# EAGLE design TinyCam Carrier Board (EAGLE 9.6.2)
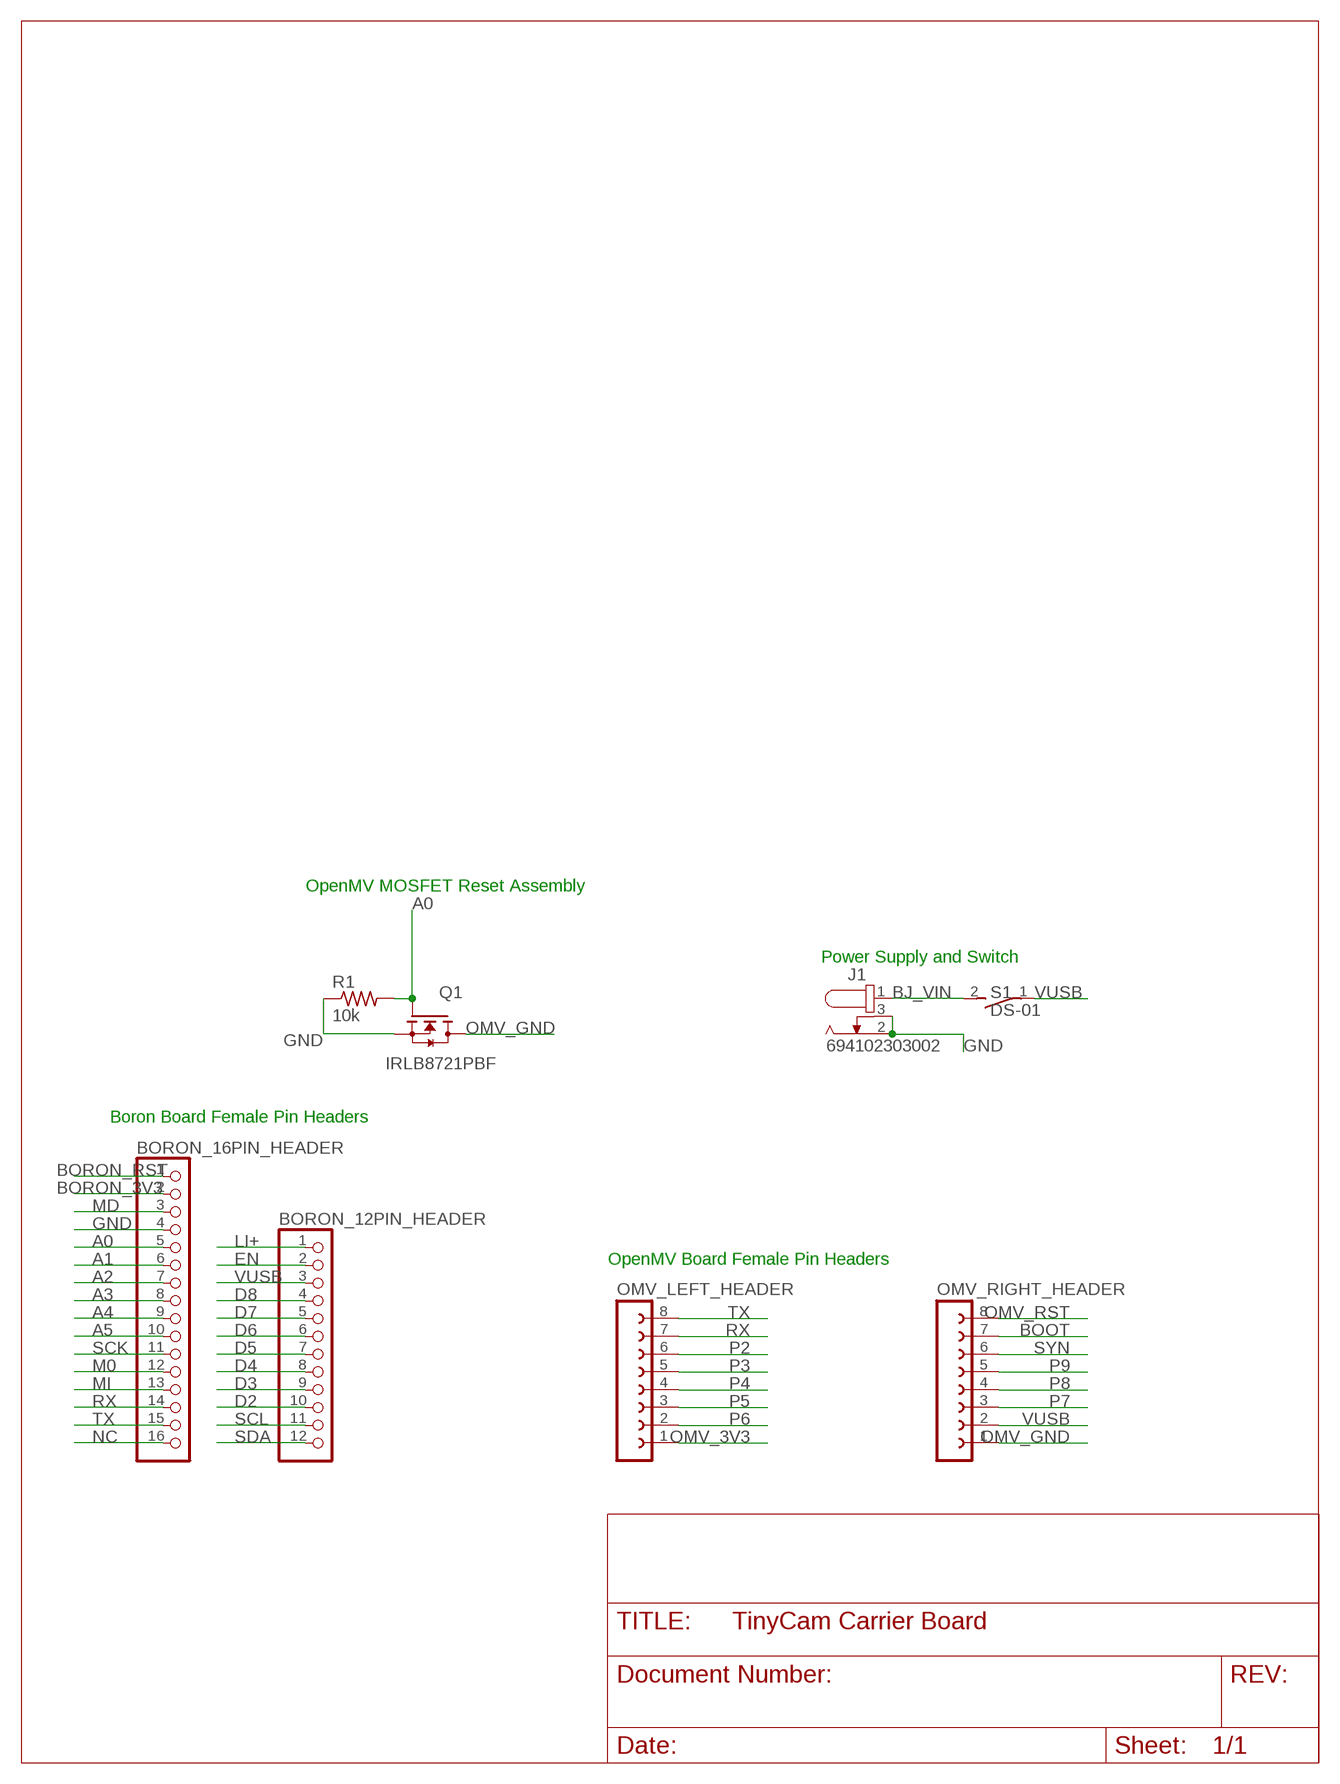
[diagram p0: schematic, sheet 1]

## Parts
BORON_12PIN_HEADER  PINHD-1X12  [1X12]
BORON_16PIN_HEADER  PINHD-1X16  [1X16]
J1  694102303002  694102303002  [694102303002]
OMV_LEFT_HEADER  FE08-1  [FE08]
OMV_RIGHT_HEADER  FE08-1  [FE08]
Q1  IRLB8721PBF  [TO254P1067X483X2057-3]
R1  10k  R-US_0204/7  [0204/7]
S1  DS-01  DS01E  [DS-01]

## Nets
A0: BORON_16PIN_HEADER.5 Q1.1(G) R1.2
A1: BORON_16PIN_HEADER.6
A2: BORON_16PIN_HEADER.7
A3: BORON_16PIN_HEADER.8
A4: BORON_16PIN_HEADER.9
A5: BORON_16PIN_HEADER.10
BJ_VIN: J1.1 S1.2
BOOT: OMV_RIGHT_HEADER.7
BORON_3V3: BORON_16PIN_HEADER.2
BORON_RST: BORON_16PIN_HEADER.1
D2: BORON_12PIN_HEADER.10
D3: BORON_12PIN_HEADER.9
D4: BORON_12PIN_HEADER.8
D5: BORON_12PIN_HEADER.7
D6: BORON_12PIN_HEADER.6
D7: BORON_12PIN_HEADER.5
D8: BORON_12PIN_HEADER.4
EN: BORON_12PIN_HEADER.2
GND: BORON_16PIN_HEADER.4 J1.2 J1.3 Q1.3(S) R1.1
LI+: BORON_12PIN_HEADER.1
M0: BORON_16PIN_HEADER.12
MD: BORON_16PIN_HEADER.3
MI: BORON_16PIN_HEADER.13
NC: BORON_16PIN_HEADER.16
OMV_3V3: OMV_LEFT_HEADER.1
OMV_GND: OMV_RIGHT_HEADER.1 Q1.2(D)
OMV_RST: OMV_RIGHT_HEADER.8
P2: OMV_LEFT_HEADER.6
P3: OMV_LEFT_HEADER.5
P4: OMV_LEFT_HEADER.4
P5: OMV_LEFT_HEADER.3
P6: OMV_LEFT_HEADER.2
P7: OMV_RIGHT_HEADER.3
P8: OMV_RIGHT_HEADER.4
P9: OMV_RIGHT_HEADER.5
RX: BORON_16PIN_HEADER.14 OMV_LEFT_HEADER.7
SCK: BORON_16PIN_HEADER.11
SCL: BORON_12PIN_HEADER.11
SDA: BORON_12PIN_HEADER.12
SYN: OMV_RIGHT_HEADER.6
TX: BORON_16PIN_HEADER.15 OMV_LEFT_HEADER.8
VUSB: BORON_12PIN_HEADER.3 OMV_RIGHT_HEADER.2 S1.1

## Notes on the sheet
- OpenMV MOSFET Reset Assembly
- Power Supply and Switch
- Boron Board Female Pin Headers
- OpenMV Board Female Pin Headers

## Library data of the parts
BORON_12PIN_HEADER = pinhead:PINHD-1X12: PIN HEADER
BORON_16PIN_HEADER = pinhead:PINHD-1X16: PIN HEADER
J1 = Eagle_WR-DC (rev21a):694102303002: WR-DC DC Power Jack Right Angled (4.2) KIND PROPERTIES Quality Class 5 000 Mating cycles Type Right Angled MATERIAL PROPERTIES Insulator Material PA66 Insulator Flammability Rating UL94 V-0 Color Black Contact Material Copper Alloy Contact Type Stamped Center Pin Plating Gold Center Pin Terminal Plating Tin Tip Spring Material Tin Shunt Terminal Plating Tin GENERAL INFORMATION Operating Temperature -40 up to +85 °C Compliance RoHS ELECTRICAL PROPERTIES IR 1 2 A Working Voltage 30 V (AC) Withstanding Voltage 500 V (AC) Contact Resistance 50 mΩ RISO 100 MΩ PACKAGING PROPERTIES Packaging Bag <https://www.we-online.com/catalog/media/o64601v209%20Family_WR-DC_THT_6941xx303002.jpg> Details see: https://www.we-online.com/catalog/en/DC_RIGHT_ANGLED_4_2_69410X303002 Updated by Ella Wu 2021-09-30 2021(C) Wurth Elektronik; DATASHEET-URL: https://www.we-online.com/catalog/datasheet/694102303002.pdf; IR: 2A; MOUNT: THT; PART-NUMBER: 694102303002; TYPE: Right Angled; WORKING-VOLTAGE: 30V(AC)
OMV_LEFT_HEADER OMV_RIGHT_HEADER = con-lsta:FE08-1: FEMALE HEADER; OC_FARNELL: unknown; OC_NEWARK: unknown
Q1 = IRLB8721PBF:IRLB8721PBF: Single N-Channel 30 V 8.7 mOhm 13 nC HEXFET® Power Mosfet - TO-220-3; CHECK_PRICES: https://www.snapeda.com/parts/IRLB8721PBF/Infineon/view-part/?ref=eda; DESCRIPTION: IRLB8721PBF N-channel MOSFET Transistor, 62 A, 30 V, 3-Pin TO-220AB | Infineon IRLB8721PBF; DIGIKEY_PART_NUMBER: IRLB8721PBF-ND; MF: Infineon Technologies; MP: IRLB8721PBF; PACKAGE: TO-220-3 Infineon; SNAPEDA_LINK: https://www.snapeda.com/parts/IRLB8721PBF/Infineon/view-part/?ref=snap
R1 = rcl:R-US_: RESISTOR, American symbol; SPICEPREFIX: R
S1 = Switch:DS01E: DIL/CODE SWITCH; CATEGORY: SWITCH; TYPE: SPST

## Board
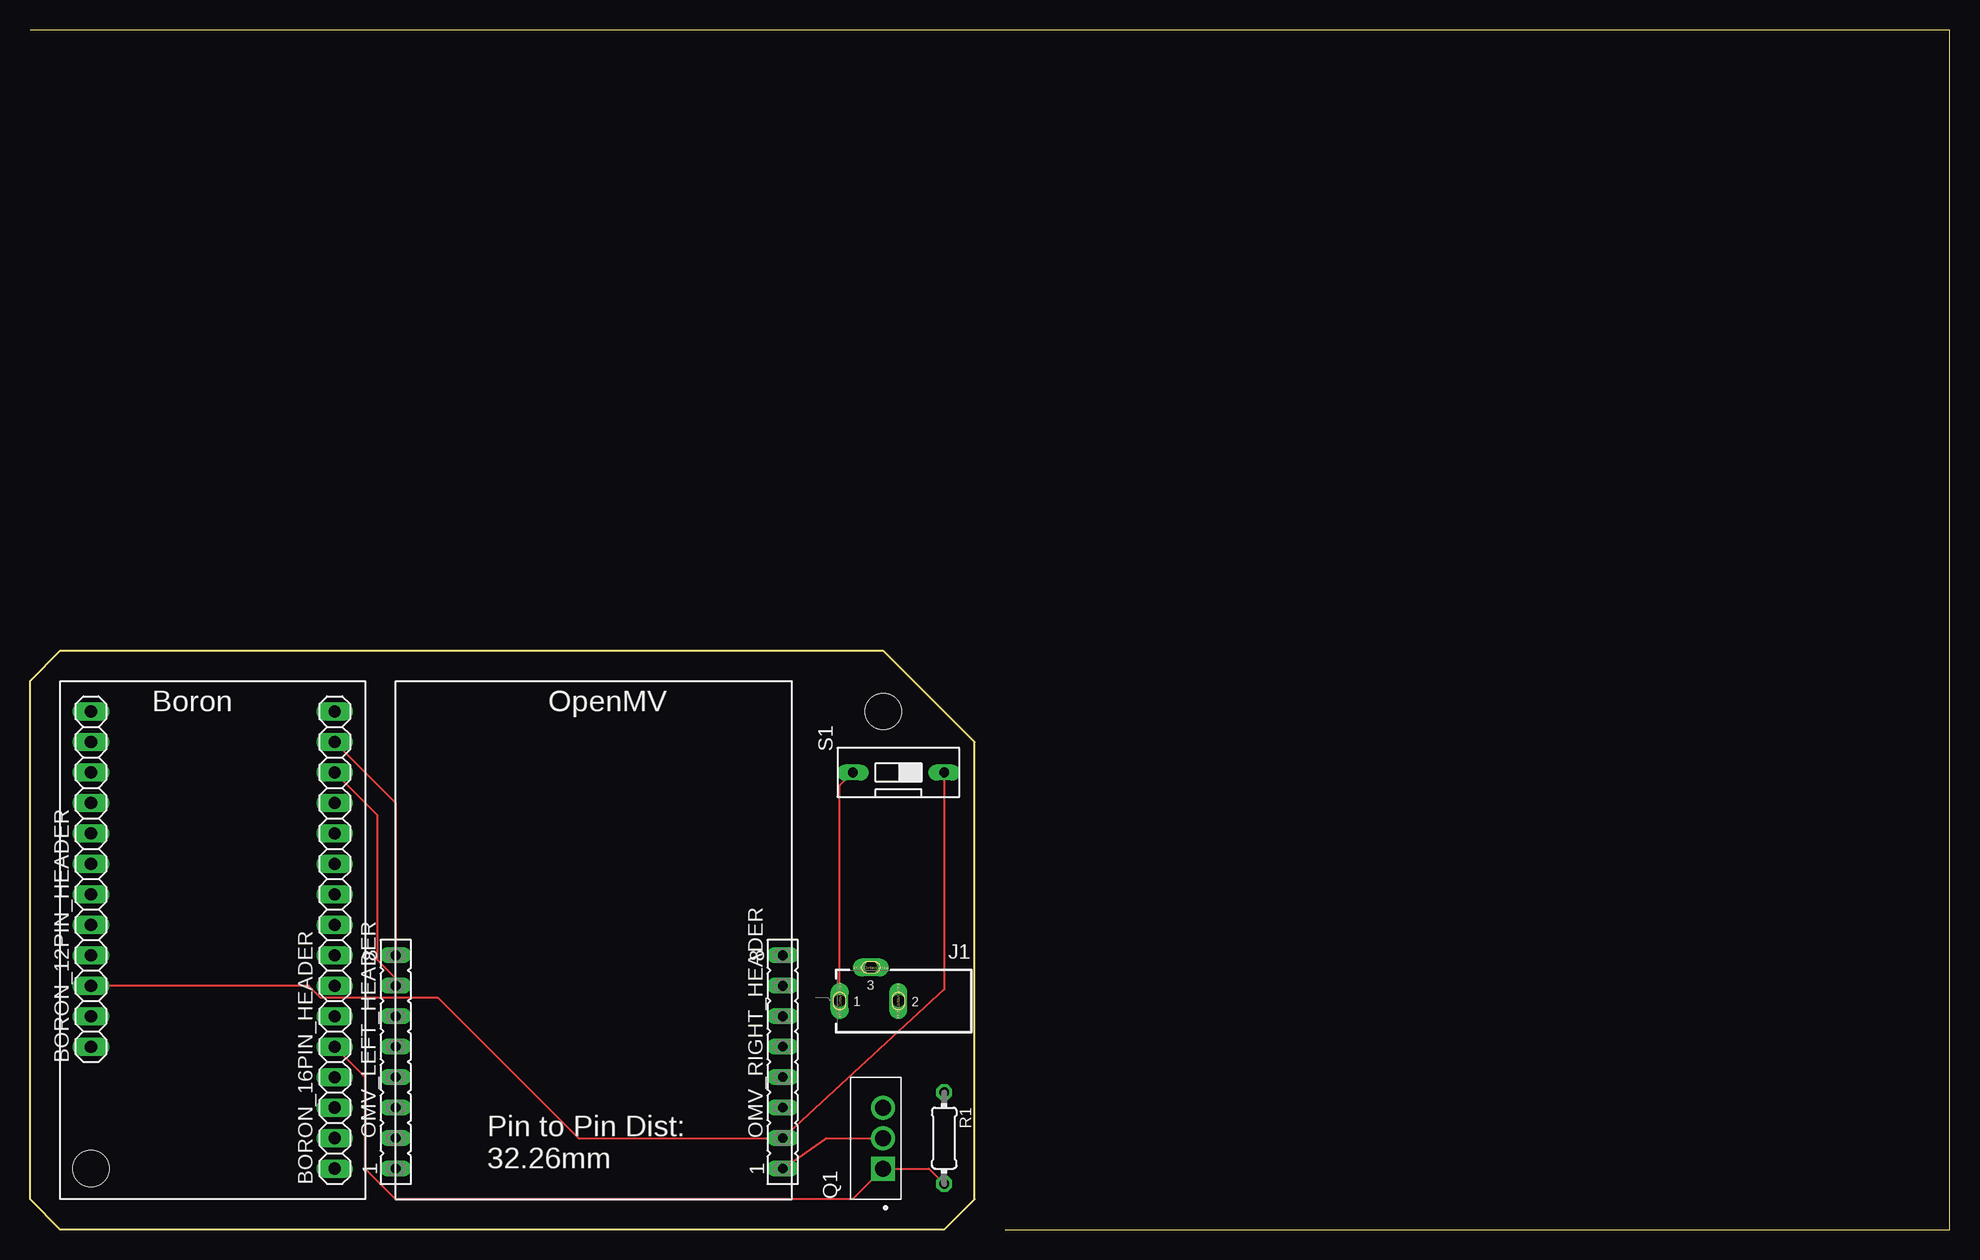
[diagram p1: board, top side]
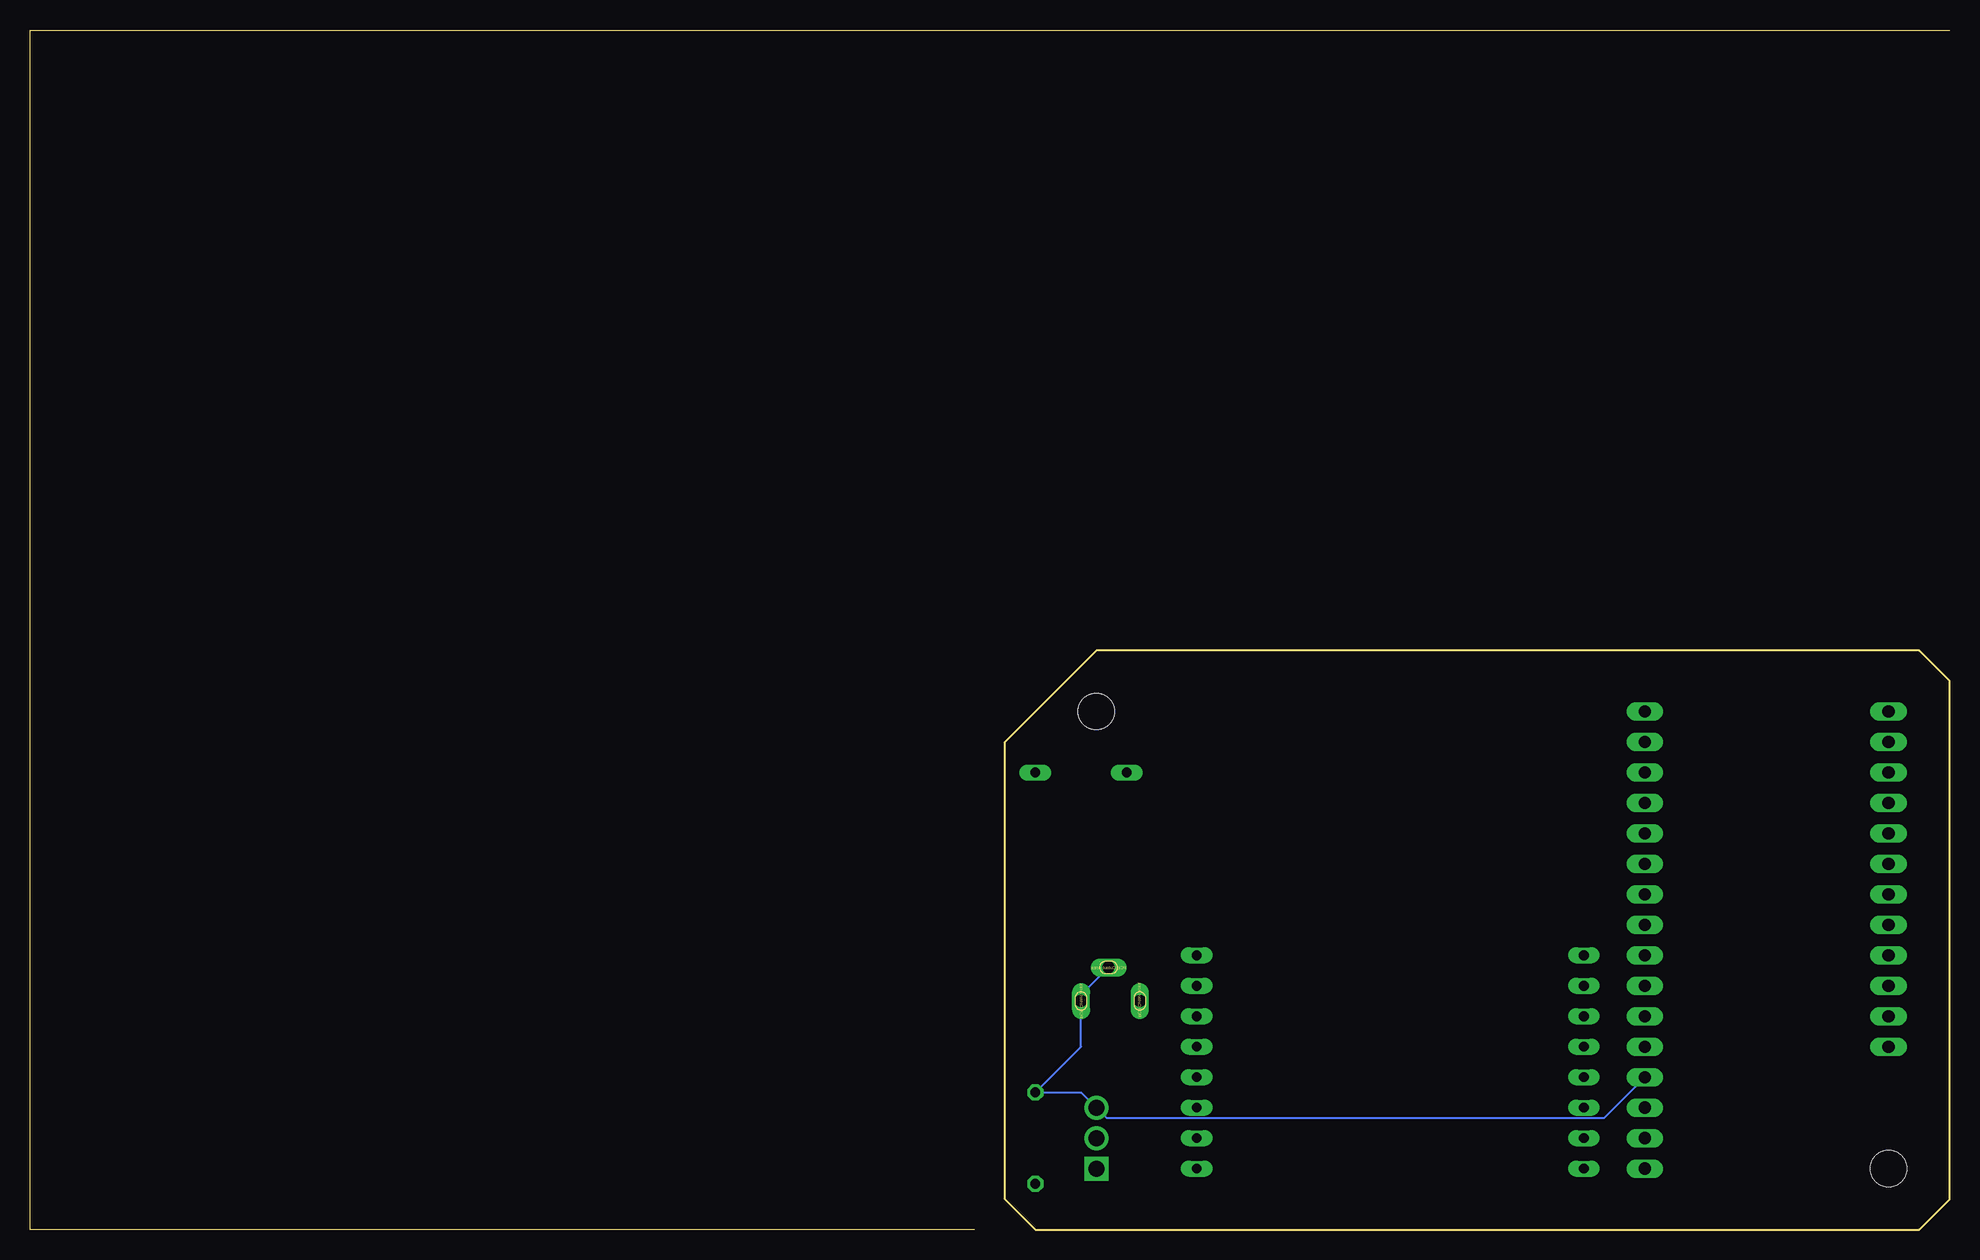
[diagram p2: board, bottom side, seen from below]

Size 160 x 100 mm. Coordinates in mm from the lower left corner, seen from the top.
Outline: 81.28,0 160,0 160,100 0,100
Outline: 2.54,48.26 71.12,48.26 78.74,40.64 78.74,2.54 76.2,0 2.54,0 0,2.54 0,45.72 2.54,48.26
Copper layers (1*16): Top 0.035mm / dielectric 1.5mm / Bottom 0.035mm
Design rules "default": minimum track width 6mil, minimum drill 0.35mm, track to track 6mil, track to pad 6mil, pad to pad 6mil, via to via 6mil, smd to smd 6mil, copper to edge 40mil, drill to drill 6mil, minimum pad ring 10mil, minimum via ring 8mil, stop-mask expansion 4mil, vias tented up to drill 0mil, thermal gap 10mil
Holes 3 mm at 71.12,43.18 5.08,5.08

### Footprints (pad centres in the part's own frame; a part is rotated, then mirrored left to right if it is on the bottom)
1X12 = drill 1.016 long: 1 -13.97,0; 2 -11.43,0; 3 -8.89,0; 4 -6.35,0; 5 -3.81,0; 6 -1.27,0; 7 1.27,0; 8 3.81,0; 9 6.35,0; 10 8.89,0; 11 11.43,0; 12 13.97,0
1X16 = drill 1.016 long: 1 -19.05,0; 2 -16.51,0; 3 -13.97,0; 4 -11.43,0; 5 -8.89,0; 6 -6.35,0; 7 -3.81,0; 8 -1.27,0; 9 1.27,0; 10 3.81,0; 11 6.35,0; 12 8.89,0; 13 11.43,0; 14 13.97,0; 15 16.51,0; 16 19.05,0
694102303002 = drill 1 pad 1.5 long: 1 4.9,0; 2 0,0; 3 2.3,-2.8
FE08 = drill 0.813 long: 1 -8.89,0; 2 -6.35,0; 3 -3.81,0; 4 -1.27,0; 5 1.27,0; 6 3.81,0; 7 6.35,0; 8 8.89,0
TO254P1067X483X2057-3 = drill 1.33 pad 2 square: 1 -2.54,0 | drill 1.33 pad 2: 2 0,0; 3 2.54,0
0204/7 = drill 0.813 octagon: 1 -3.81,0; 2 3.81,0
DS-01 = drill 0.813 long: 1 0,-3.81; 2 0,3.81

### Placement (x,y rotation side)
BORON_12PIN_HEADER  5.08,29.21 90 top
BORON_16PIN_HEADER  25.4,24.13 90 top
J1  72.39,19.05 180 top
OMV_LEFT_HEADER  30.48,13.97 90 top
OMV_RIGHT_HEADER  62.74,13.97 90 top
Q1  71.12,7.62 90 top
R1  76.2,7.62 270 top
S1  72.39,38.1 90 top

### Tracks (layer width: path | path; a pad name or v marks a point on that pad's centre or on a via)
A0
  Top 0.152: R1.2 74.93,5.08 Q1.1 68.58,2.54 30.48,2.54 27.94,5.08 27.94,12.7 BORON_16PIN_HEADER.5
BJ_VIN
  Top 0.152: J1.1 67.49,37.01 S1.2
GND
  Bottom 0.152: J1.3 72.39,19.55 J1.2 72.39,15.24 R1.1 72.39,11.43 Q1.3 70.23,9.27 28.83,9.27 BORON_16PIN_HEADER.4
OMV_GND
  Top 0.152: OMV_RIGHT_HEADER.1 66.34,7.62 Q1.2
RX
  Top 0.152: OMV_LEFT_HEADER.7 30.48,20.94 28.93,22.49 28.93,34.57 BORON_16PIN_HEADER.14
TX
  Top 0.152: BORON_16PIN_HEADER.15 30.48,35.56 OMV_LEFT_HEADER.8
VUSB
  Top 0.152: S1.1 76.2,20.02 OMV_RIGHT_HEADER.2 45.72,7.62 34.01,19.33 24.23,19.33 23.24,20.32 BORON_12PIN_HEADER.3

### Text on the board
tNames: Boron | OpenMV | Pin to Pin Dist: / 32.26mm
tValues: ON | OFF